# Altium schematic sheet AUDIO_INTERFACE.SchDoc
size A4; SheetNumber: 23; SheetTotal: 27
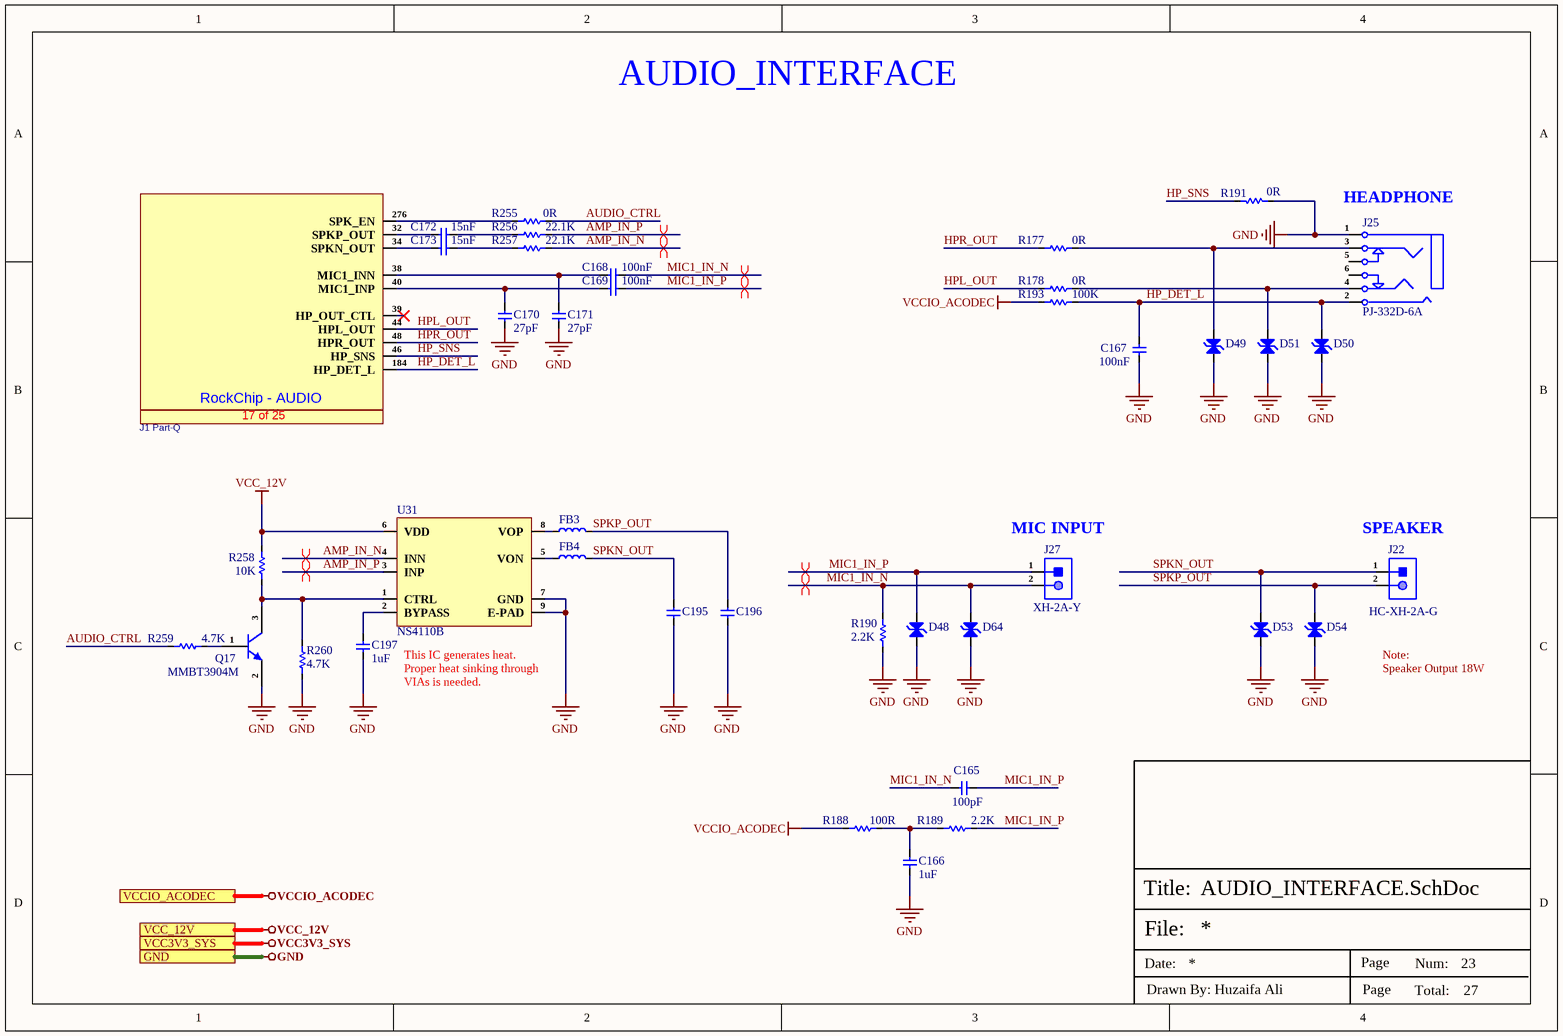
[diagram p0: AUDIO_INTERFACE.SchDoc]

## Parts
C165  100pF  [Cap-0402]
C166  1uF  [Cap-0402]
C167  100nF  [Cap-0402]
C168  100nF  [Cap-0402]
C169  100nF  [Cap-0402]
C170  27pF  [Cap-0402]
C171  27pF  [Cap-0402]
C172  15nF  [Cap-0402]
C173  15nF  [Cap-0402]
C195  (no value)  [CAP-0603]
C196  (no value)  [CAP-0603]
C197  1uF  [Cap-0603]
D48  ESD5451N  [DFN1006-2L (Bi-Directional)]  (value not drawn)
D49  ESD5451N  [DFN1006-2L (Bi-Directional)]  (value not drawn)
D50  ESD5451N  [DFN1006-2L (Bi-Directional)]  (value not drawn)
D51  ESD5451N  [DFN1006-2L (Bi-Directional)]  (value not drawn)
D53  ESD5451N  [DFN1006-2L (Bi-Directional)]  (value not drawn)
D54  ESD5451N  [DFN1006-2L (Bi-Directional)]  (value not drawn)
D64  ESD5451N  [DFN1006-2L (Bi-Directional)]  (value not drawn)
FB3  (no value)  [IND-1206]
FB4  (no value)  [IND-1206]
J1_Part-  AS0B826-S78B-7H  [AS0B826-S78B-7H]  (value not drawn)  (part Q of 25)
J22  HC-XH-2A-G  [HC-XH-2A-G]
J25  PJ-332D-6A  [PJ-332D-6A]
J27  XH-2A-Y  [XH-2A-Y]
Q17  MMBT3904M  [SOT-723]
R177  0R  [Res-0402]
R178  0R  [Res-0402]
R188  100R  [Res-0402]
R189  2.2K  [Res-0402]
R190  2.2K  [Res-0402]
R191  0R  [Res-0402]
R193  100K  [Res-0402]
R255  0R  [Res-0402]
R256  22.1K  [Res-0402]
R257  22.1K  [Res-0402]
R258  10K  [Res-0402]
R259  4.7K  [Res-0402]
R260  4.7K  [Res-0402]
U31  NS4110B  [8-SOIC-EP]

## Ports
GND (see TOP SHEET[3D], BUCK REGULATOR[3D], DEBUG_UART_INTERFACE[3D], DIGITAL IO_RELAY_SHEET[5D], DUAL_SIM_INTERFACE[3D], ETHERNET_PHY0[4D], ETHERNET_PHY1[4D], GSM_INTERFACE[2D], HDMI_INTERFACE[3D], INPUT_PROTECTION[3D], LINEAR_VOLTAGE_REG[3D], MICRO_SD_INTERFACE[3D], MIPI-DSI DISPLAY[3D], POWER SECTION[3D], PUSH BUTTONs_INTERFACE[3C], RGB_LEDs_INTERFACE[3D], ROCKCHIP_PWR_SUPPLY[1D], ROCKCHIP_SYSTEM_CONTROL[3C], RS232_RS485_INTERFACE[3C], SENSOR_SHEET[3D], USB2.0_INTERFACE[3D], USB3.0_INTERFACE[3D], USB-C_INTERFACE[2D], WIEGAND_INTERFACE[3D], WIFI_BLUETOOTH_SHEET[4C]), VCC3V3_SYS (see TOP SHEET[3D], BUCK REGULATOR[3D], DEBUG_UART_INTERFACE[3D], DIGITAL IO_RELAY_SHEET[5D], ETHERNET_PHY0[4D], ETHERNET_PHY1[4D], GSM_INTERFACE[2D], HDMI_INTERFACE[3D], LINEAR_VOLTAGE_REG[3D], MIPI-DSI DISPLAY[3D], POWER SECTION[3D], PUSH BUTTONs_INTERFACE[3C], ROCKCHIP_PWR_SUPPLY[1D], ROCKCHIP_SYSTEM_CONTROL[3C], RS232_RS485_INTERFACE[3C], SENSOR_SHEET[3D], USB-C_INTERFACE[2D], WIEGAND_INTERFACE[3D], WIFI_BLUETOOTH_SHEET[4C]), VCC_12V (see TOP SHEET[3D], BUCK REGULATOR[3D], INPUT_PROTECTION[3D], POWER SECTION[3D], PUSH BUTTONs_INTERFACE[3C], WIEGAND_INTERFACE[3D]), VCCIO_ACODEC (see TOP SHEET[3D], ROCKCHIP_PWR_SUPPLY[2D])

## Nets
GND: C166.1 C167.1 C170.1 C171.1 C195.1 C196.1 C197.1 D48.1(K) D49.1(K) D50.1(K) D51.1(K) D53.1(K) D54.1(K) D64.1(K) J25.1 Q17.2(E) R190.1 R191.1 R260.1 U31.7(GND) U31.9(E-PAD) ; port GND
VCC3V3_SYS: port VCC3V3_SYS
VCC_12V: R258.2 U31.6(VDD) ; port VCC_12V
VCCIO_ACODEC: R188.1 R193.2 ; port VCCIO_ACODEC
AMP_IN_N: R257.2 U31.4(INN)
AMP_IN_P: R256.2 U31.3(INP)
AUDIO_CTRL: R255.2 R259.1
HP_DET_L: C167.2 D50.2(K) J1_Part-.184(HP_DET_L) J25.2 R193.1
HP_SNS: J1_Part-.46(HP_SNS) R191.2
HPL_OUT: J1_Part-.44(HPL_OUT) R178.1
HPR_OUT: J1_Part-.48(HPR_OUT) R177.1
MIC1_IN_N: C165.2 C169.1 D64.2(K) J27.2 R190.2
MIC1_IN_P: C165.1 C168.1 D48.2(K) J27.1 R189.2
SPKN_OUT: C195.2 D53.2(K) FB4.2 J22.1
SPKP_OUT: C196.2 D54.2(K) FB3.2 J22.2
NetC166_2: C166.2 R188.2 R189.1
NetC168_2: C168.2 C170.2 J1_Part-.40(MIC1_INP)
NetC169_2: C169.2 C171.2 J1_Part-.38(MIC1_INN)
NetC172_1: C172.1 J1_Part-.32(SPKP_OUT)
NetC172_2: C172.2 R256.1
NetC173_1: C173.1 J1_Part-.34(SPKN_OUT)
NetC173_2: C173.2 R257.1
NetC197_2: C197.2 U31.2(BYPASS)
NetD49_2: D49.2(K) J25.3 R177.2
NetD51_2: D51.2(K) J25.4 R178.2
NetFB3_1: FB3.1 U31.8(VOP)
NetFB4_1: FB4.1 U31.5(VON)
NetJ1_Part-_276: J1_Part-.276(SPK_EN) R255.1
NetQ17_1: Q17.1(B) R259.2
NetQ17_3: Q17.3(C) R258.1 R260.2 U31.1(CTRL)

Not connected (* = marked no-connect by the designer): J1_Part- 39(HP_OUT_CTL)*; J25 5 6

## Layout directives
differential pair; differential pair class DIFF-AMP; rule Matched Net Lengths [Tolerance = 0.508mm]; rule Impedance Constraint [Min = 85.00    Max = 95.00    ]: AMP_IN_N, AMP_IN_P
differential pair; differential pair class DIFF-MIC; rule Matched Net Lengths [Tolerance = 0.508mm]; rule Impedance Constraint [Min = 85.00    Max = 95.00    ]: MIC1_IN_N, MIC1_IN_P

## Notes on the sheet
- AUDIO_INTERFACE
- (near J25) HEADPHONE
- (near J27) MIC INPUT
- (near J22) SPEAKER
- This IC generates heat. Proper heat sinking through VIAs is needed.
- Note:
  Speaker Output 18W
- File:
- Title:
- Date:
- Page
- Num:
- Total:
- Drawn By: Huzaifa Ali
- (in symbol AS0B826-S78B-7H, part Q) RockChip - AUDIO; 17 of 25

## Library data of the parts
C165 = CC0402JRNPO9BN101: CAP CER 100PF 50V C0G/NPO 0402; Manufacturer: Yageo; Dielectric Material: Ceramic; Tolerance: 5%; Dielectric: C0G; Temperature Coefficient: 30ppm/°C; Insulation Resistance: 100GR; Item Type: Capacitor; Supplier: Future Electronics; Supplier Part Number: 8934564; Manufacturer Part Number: CC0402JRNPO9BN101; RoHS: Yes; Category: Ceramic Capacitors; Stock: 11720000; Pricing: 10000=0.002, 40000=0.0019, 150000=0.0018, 400000=0.0018, 1000000=0.0017 (USD); Mounting Technology: Surface Mount; Case/Package: 0402; Pins: 2; Case Code (Imperial): 0402; Case Code (Metric): 1005; Min Operating Temperature: -55°C; Max Operating Temperature: 125°C; Value: 100pF; Voltage Rating: 50V; Voltage Rating (DC): 50V; Packaging: Tape and Reel; Package Quantity: 1; Termination: SMD/SMT; Voltage: 50V; Series: CC; Length: 1mm; Width: 0.02inch; Height: 0.5mm; Thickness: 0.022inch; Depth: 0.5mm; Radiation Hardening: No; RoHS Compliant: Yes; Reach SVHC Compliant: No; Lead Free: Lead Free; ComponentLink1URL: https://datasheet.ciiva.com/11786/0900766b80d84fbf-11786101.pdf?src-supplier=Rs; ComponentLink1Description: https://datasheet.ciiva.com/11786/0900766b80d84fbf-11786101.pdf?src-supplier=Rs; ComponentLink2URL: https://datasheet.ciiva.com/23767/25787-23767888.pdf?src-supplier=Newark; ComponentLink2Description: https://datasheet.ciiva.com/23767/25787-23767888.pdf?src-supplier=Newark; ComponentLink3URL: https://datasheet.ciiva.com/28450/1443161-28450220.pdf?src-supplier=Element14; ComponentLink3Description: https://datasheet.ciiva.com/28450/1443161-28450220.pdf?src-supplier=Element14; ComponentLink4URL: https://datasheet.ciiva.com/8033/1443161-8033598.pdf?src-supplier=Element14; ComponentLink4Description: https://datasheet.ciiva.com/8033/1443161-8033598.pdf?src-supplier=Element14; ComponentLink5URL: https://datasheet.ciiva.com/143/mlccorderingcode-143990.pdf?src-supplier=Digi-Key; ComponentLink5Description: https://datasheet.ciiva.com/143/mlccorderingcode-143990.pdf?src-supplier=Digi-Key; ComponentLink6URL: https://datasheet.ciiva.com/143/mlccorderingcode-143989.pdf?src-supplier=Digi-Key; ComponentLink6Description: https://datasheet.ciiva.com/143/mlccorderingcode-143989.pdf?src-supplier=Digi-Key; ComponentLink7URL: https://datasheet.ciiva.com/143/mlccorderingcode-143991.pdf?src-supplier=Digi-Key; ComponentLink7Description: https://datasheet.ciiva.com/143/mlccorderingcode-143991.pdf?src-supplier=Digi-Key; LCSC Part Number: C106200
C166 = CC0402KRX5R8BB105: CAP CER 1UF 25V X5R 0402; Manufacturer: Yageo; Tolerance: 10%; Supplier 1: Mouser; Manufacturer Part Number: CC0402KRX5R8BB105; RoHS: Yes; Category: Ceramic Capacitors; Stock 1: 91975; Pricing 1: 1=0.30000, 10=0.20400, 50=0.20400, 100=0.11600, 1000=0.07200, 10000=0.05900 (USD); Mount: Surface Mount; Case/Package: 0402; Case Code (Metric): 1005; Case Code (Imperial): 0402; Weight: 2.3E-05oz; Min Operating Temperature: -55°C; Max Operating Temperature: 85°C; Packaging: Tape and Reel; Capacitance: 1uF; Voltage Rating: 25V; Dielectric: X5R; Termination: SMD/SMT; Voltage Rating (DC): 25V; Package Quantity: 10000; Length: 0.039inch; Width: 0.02inch; Thickness: 0.022inch; Lead Free: Lead Free; Halogen Free: Halogen Free; RoHS Compliant: Yes; ComponentLink1URL: http://www.mouser.com/ds/2/447/Yageo_UPY-GP_NP0_16V-to-50V_9-358835.pdf?src-supplier=Mouser; ComponentLink1Description: http://www.mouser.com/ds/2/447/Yageo_UPY-GP_NP0_16V-to-50V_9-358835.pdf?src-supplier=Mouser; ComponentLink2URL: http://www.yageo.com/documents/recent/UPY-GPHC_X5R_4V-to-50V_25.pdf?src-supplier=Digi-Key; ComponentLink2Description: http://www.yageo.com/documents/recent/UPY-GPHC_X5R_4V-to-50V_25.pdf?src-supplier=Digi-Key; ComponentLink3URL: https://4donline.ihs.com/images/VipMasterIC/IC/YAGO/YAGO-S-A0006851646/YAGO-S-A0006851646-1.pdf?hkey=6D3A4C79FDBF58556ACFDE234799DDF0&src-supplier=Newark; ComponentLink3Description: https://4donline.ihs.com/images/VipMasterIC/IC/YAGO/YAGO-S-A0006851646/YAGO-S-A0006851646-1.pdf?hkey=6D3A4C79FDBF58556ACFDE234799DDF0&src-supplier=Newark; Supplier Part Number 1: 603-CC402KRX5R8BB105; LCSC Part Number: C326568
C167-C169 = CC0402KRX5R7BB104: CAP CER 0.1UF 16V X5R 0402; Manufacturer: Yageo; Tolerance: 10%; Manufacturer Part Number: CC0402KRX5R7BB104; RoHS: Yes; Category: Ceramic Capacitors; Supplier 1: Mouser; Stock 1: 936792; Pricing 1: 1=0.10000, 10=0.02300, 50=0.02300, 100=0.01100, 1000=0.00600, 10000=0.00400 (USD); Mount: Surface Mount; Case/Package: 0402; Number of Pins: 2; Case Code (Metric): 1005; Case Code (Imperial): 0402; Min Operating Temperature: -55°C; Max Operating Temperature: 85°C; Capacitance: 100nF; Dielectric: X5R; Packaging: Tape and Reel; Voltage Rating: 16V; Package Quantity: 1; Voltage Rating (DC): 16V; Termination: SMD/SMT; Resistor Type: Ceramic; Series: CC; Construction: Flat; Length: 1mm; Width: 0.02inch; Height: 0.5mm; Thickness: 0.022inch; Depth: 0.5mm; Radiation Hardening: No; REACH SVHC: Unknown; Lead Free: Lead Free; Halogen Free: Halogen Free; RoHS Compliant: Yes; ComponentLink1URL: https://datasheet.ciiva.com/155/mlccorderingcode-155879.pdf?src-supplier=Digi-Key; ComponentLink1Description: https://datasheet.ciiva.com/155/mlccorderingcode-155879.pdf?src-supplier=Digi-Key; ComponentLink2URL: https://datasheet.ciiva.com/155/mlccorderingcode-155878.pdf?src-supplier=Digi-Key; ComponentLink2Description: https://datasheet.ciiva.com/155/mlccorderingcode-155878.pdf?src-supplier=Digi-Key; ComponentLink3URL: https://datasheet.ciiva.com/155/mlccorderingcode-155880.pdf?src-supplier=Digi-Key; ComponentLink3Description: https://datasheet.ciiva.com/155/mlccorderingcode-155880.pdf?src-supplier=Digi-Key; ComponentLink4URL: https://datasheet.ciiva.com/11464/upy-gphc-x5r-4v-to-50v-12-11464869.pdf?src-supplier=Avnet; ComponentLink4Description: https://datasheet.ciiva.com/11464/upy-gphc-x5r-4v-to-50v-12-11464869.pdf?src-supplier=Avnet; Supplier Part Number 1: 603-CC402KRX5R7BB104; LCSC Part Number: C106204
C170 C171 = 0402N270J250CT: CAP CER 27PF 25V C0G/NP0 0402; Manufacturer: Walsin Technologies; Item Type: Capacitor; Supplier 1: Digi-Key; Manufacturer Part Number: 0402N270J250CT; Stock 1: 71180; Pricing 1: 1=0.1, 10=0.017, 50=0.0094, 100=0.0076, 500=0.00544, 1000=0.00427, 2500=0.00388, 5000=0.00357 (USD); RoHS Compliant: Yes; Supplier Part Number 1: 1292-1291-1-ND; LCSC Part Number: C424826; ComponentLink1Description: LCSC; ComponentLink1URL: https://lcsc.com/product-detail/Multilayer-Ceramic-Capacitors-MLCC-SMD-SMT_Walsin-Tech-Corp-0402N270J250CT_C424826.html
C172 C173 = CC0402KRX7R9BB153: CAP CER 0.015UF 50V X7R 0402; Manufacturer: Yageo; Tolerance: 10%; Item Type: Capacitor; Supplier: Future Electronics; Supplier Part Number: 1105976; Manufacturer Part Number: CC0402KRX7R9BB153; RoHS: Yes; Category: Ceramic Capacitors; Stock: 10000; Pricing: 10000=0.0032, 40000=0.0031, 150000=0.0029, 250000=0.0028, 500000=0.0027 (USD); Mounting Technology: Surface Mount; Case/Package: 0402; Min Operating Temperature: -55°C; Max Operating Temperature: 125°C; Packaging: Tape and Reel; Value: 15nF; Voltage Rating: 50V; Voltage Rating (DC): 50V; Dielectric: X7R; Series: CC; Length: 0.039inch; Width: 0.02inch; Thickness: 0.022inch; Lead Free: Lead Free; Halogen Free: Halogen Free; RoHS Compliant: Yes; ComponentLink1URL: https://datasheet.octopart.com/CC0402KRX7R9BB153-Yageo-datasheet-166511530.pdf?src-supplier=Future+Electronics; ComponentLink1Description: https://datasheet.octopart.com/CC0402KRX7R9BB153-Yageo-datasheet-166511530.pdf?src-supplier=Future+Electronics; ComponentLink2URL: https://datasheet.octopart.com/CC0402KRX7R9BB153-Yageo-datasheet-147453679.pdf?src-supplier=Newark; ComponentLink2Description: https://datasheet.octopart.com/CC0402KRX7R9BB153-Yageo-datasheet-147453679.pdf?src-supplier=Newark; ComponentLink3URL: http://www.yageo.com/documents/recent/UPY-GPHC_X7R_6.3V-to-50V_18.pdf?src-supplier=Digi-Key; ComponentLink3Description: http://www.yageo.com/documents/recent/UPY-GPHC_X7R_6.3V-to-50V_18.pdf?src-supplier=Digi-Key; ComponentLink4URL: https://www.yageo.com/upload/media/product/productsearch/datasheet/mlcc/UPY-GPHC_X7R_6.3V-to-50V_18.pdf?src-supplier=Digi-Key; ComponentLink4Description: https://www.yageo.com/upload/media/product/productsearch/datasheet/mlcc/UPY-GPHC_X7R_6.3V-to-50V_18.pdf?src-supplier=Digi-Key; ComponentLink5URL: https://datasheet.octopart.com/CC0402KRX7R9BB153-Yageo-datasheet-151948686.pdf?src-supplier=Farnell; ComponentLink5Description: https://datasheet.octopart.com/CC0402KRX7R9BB153-Yageo-datasheet-151948686.pdf?src-supplier=Farnell; ComponentLink6URL: http://www.yageo.com/exep/pages/download/literatures/ProductSelectionGuide%202014_Final_2.pdf?src-supplier=Digi-Key; ComponentLink6Description: http://www.yageo.com/exep/pages/download/literatures/ProductSelectionGuide%202014_Final_2.pdf?src-supplier=Digi-Key; LCSC Part Number: C114405
C195 C196 = CC0603JRNPO8BN102: CAP CER 1000PF 25V C0G/NPO 0603; Manufacturer: Yageo; Capacitance: 1nF; Tolerance: 5%; Dielectric: C0G; Item Type: Capacitor; Supplier 1: Digi-Key; Manufacturer Part Number: CC0603JRNPO8BN102; Stock 1: 290818; Pricing 1: 1=0.1, 10=0.072, 50=0.0394, 100=0.0322, 500=0.02298, 1000=0.01806 (USD); Mount: Surface Mount; Case/Package: 0603; Case Code (Metric): 1608; Case Code (Imperial): 0603; Min Operating Temperature: -55°C; Max Operating Temperature: 125°C; Voltage Rating: 25V; Packaging: Tape and Reel; Package Quantity: 1; Termination: SMD/SMT; Voltage Rating (DC): 25V; Series: CC; Construction: Flat; Length: 1.6mm; Width: 0.031inch; Height: 0.8mm; Thickness: 0.035inch; Depth: 0.8mm; Radiation Hardening: No; REACH SVHC: Unknown; Lead Free: Lead Free; RoHS Compliant: Yes; ComponentLink1URL: http://www.farnell.com/datasheets/1132289.pdf?src-supplier=Element14; ComponentLink1Description: http://www.farnell.com/datasheets/1132289.pdf?src-supplier=Element14; ComponentLink2URL: http://www.farnell.com/datasheets/2213336.pdf?src-supplier=Element14; ComponentLink2Description: http://www.farnell.com/datasheets/2213336.pdf?src-supplier=Element14; ComponentLink3URL: http://www.yageo.com/documents/recent/UPY-GP_NP0_16V-to-50V_16.pdf?src-supplier=Digi-Key; ComponentLink3Description: http://www.yageo.com/documents/recent/UPY-GP_NP0_16V-to-50V_16.pdf?src-supplier=Digi-Key; ComponentLink4URL: http://www.yageo.com/exep/pages/download/literatures/ProductSelectionGuide%202014_Final_2.pdf?src-supplier=Digi-Key; ComponentLink4Description: http://www.yageo.com/exep/pages/download/literatures/ProductSelectionGuide%202014_Final_2.pdf?src-supplier=Digi-Key; ComponentLink5URL: http://www.yageo.com/documents/recent/UPY-GP_NP0_16V-to-50V_8.pdf?src-supplier=Avnet; ComponentLink5Description: http://www.yageo.com/documents/recent/UPY-GP_NP0_16V-to-50V_8.pdf?src-supplier=Avnet; ComponentLink6URL: https://www.verical.com/server-webapp/html/getDatasheet?partID=403523&src-supplier=Verical; ComponentLink6Description: https://www.verical.com/server-webapp/html/getDatasheet?partID=403523&src-supplier=Verical; ComponentLink7URL: http://www.yageo.com/documents/recent/UPY-GP_NP0_16V-to-50V_8.pdf?src-supplier=Avnet+Europe; ComponentLink7Description: http://www.yageo.com/documents/recent/UPY-GP_NP0_16V-to-50V_8.pdf?src-supplier=Avnet+Europe; Supplier Part Number 1: 311-1342-1-ND; LCSC Part Number: C309470
C197 = CC0603KRX5R8BB105: CAP CER 1UF 25V X5R 0603; Manufacturer: Yageo; Tolerance: 10%; Item Type: Capacitor; Supplier 1: Digi-Key; Manufacturer Part Number: CC0603KRX5R8BB105; RoHS: Yes; Category: Ceramic Capacitors; Stock 1: 919939; Pricing 1: 1=0.12000, 10=0.08400, 50=0.04760, 100=0.03940, 500=0.02764, 1000=0.02288 (USD); Mount: Surface Mount; Case/Package: 0603; Number of Pins: 2; Case Code (Metric): 1608; Case Code (Imperial): 0603; Min Operating Temperature: -55°C; Max Operating Temperature: 85°C; Capacitance: 1uF; Dielectric: X5R; Package Quantity: 1; Voltage Rating: 25V; Packaging: Tape and Reel; Termination: SMD/SMT; Voltage Rating (DC): 25V; Series: CC; Construction: Flat; Length: 1.6mm; Width: 0.031inch; Height: 0.8mm; Thickness: 0.035inch; Depth: 0.8mm; Radiation Hardening: No; REACH SVHC: No SVHC; Lead Free: Lead Free; Halogen Free: Halogen Free; RoHS Compliant: Yes; ComponentLink1URL: https://datasheet.ciiva.com/176/mlccorderingcode-176785.pdf?src-supplier=Digi-Key; ComponentLink1Description: https://datasheet.ciiva.com/176/mlccorderingcode-176785.pdf?src-supplier=Digi-Key; ComponentLink2URL: https://datasheet.ciiva.com/176/mlccorderingcode-176786.pdf?src-supplier=Digi-Key; ComponentLink2Description: https://datasheet.ciiva.com/176/mlccorderingcode-176786.pdf?src-supplier=Digi-Key; ComponentLink3URL: https://datasheet.ciiva.com/176/mlccorderingcode-176787.pdf?src-supplier=Digi-Key; ComponentLink3Description: https://datasheet.ciiva.com/176/mlccorderingcode-176787.pdf?src-supplier=Digi-Key; ComponentLink4URL: https://datasheet.ciiva.com/17436/upy-gphc-x5r-4v-to-50v-12-17436952.pdf?src-supplier=Avnet+Europe; ComponentLink4Description: https://datasheet.ciiva.com/17436/upy-gphc-x5r-4v-to-50v-12-17436952.pdf?src-supplier=Avnet+Europe; ComponentLink5URL: https://datasheet.ciiva.com/7978/1525783-7978171.pdf?src-supplier=Element14; ComponentLink5Description: https://datasheet.ciiva.com/7978/1525783-7978171.pdf?src-supplier=Element14; ComponentLink6URL: https://datasheet.ciiva.com/11586/upy-gphc-x5r-4v-to-50v-12-11586318.pdf?src-supplier=Avnet; ComponentLink6Description: https://datasheet.ciiva.com/11586/upy-gphc-x5r-4v-to-50v-12-11586318.pdf?src-supplier=Avnet; Supplier Part Number 1: 311-1445-1-ND; LCSC Part Number: C14664
D48-D51 D53 D54 D64 = ESD5451N: DFN1006-2(0402) ESD Protection Devices ROHS; Manufacturer: TECH PUBLIC; Manufacturer Part Number: ESD5451N; Footprint: DFN1006-2(0402); ComponentLink1Description: LCSC; ComponentLink1URL: https://www.lcsc.com/product-detail/span-style-background-color-ff0-ESD-span-Protection-Devices_TECH-PUBLIC-ESD5451N_C2936977.html; LCSC Part Number: C2936977
FB3 FB4 = BLM31KN102SN1L: FERRITE BEAD 1K OHM 1206 1LN; Manufacturer: Murata; Supplier: Arrow Electronics; Supplier Part Number: BLM31KN102SN1L; Manufacturer Part Number: BLM31KN102SN1L; RoHS: Yes; Category: Ferrite Beads and Chips; Stock: 4330; Pricing: 1=0.2698, 10=0.1868, 25=0.1802, 100=0.1517, 250=0.1332, 500=0.1205, 1000=0.1021, 3000=0.1013 (USD); ComponentLink1URL: https://datasheet.octopart.com/BLM31KN102SN1L-Murata-datasheet-127191117.pdf?src-supplier=Future+Electronics; ComponentLink1Description: https://datasheet.octopart.com/BLM31KN102SN1L-Murata-datasheet-127191117.pdf?src-supplier=Future+Electronics; ComponentLink2URL: https://www.murata.com/en-global/products/productdata/8796739698718/ENFA0006.pdf?src-supplier=Digi-Key; ComponentLink2Description: https://www.murata.com/en-global/products/productdata/8796739698718/ENFA0006.pdf?src-supplier=Digi-Key; ComponentLink3URL: https://datasheet.octopart.com/BLM31KN102SN1L-Murata-datasheet-137977741.pdf?src-supplier=Element14; ComponentLink3Description: https://datasheet.octopart.com/BLM31KN102SN1L-Murata-datasheet-137977741.pdf?src-supplier=Element14; LCSC Part Number: C560056; Item Type: Ferrite Bead
J1_Part- = AS0B826-S78B-7H: SMD,P=0.5mm,Surface Mount，Right Angle; Manufacturer: FOXCONN; Item Type: Card Edge Connectors; Supplier: LCSC; Manufacturer Part Number: AS0B826-S78B-7H; RoHS: No; Stock: 4979; Pricing: 1=9.21, 10=8.287, 25=7.8064, 50=7.6064, 100=7.4062 (USD); LCSC Part Number: C426232
J22 = HC-XH-2A-G: 1x2P XH 1 2.54mm 2.54mm Male pin 2 -25℃~+85℃ 3A Straight Straight,P=2.5mm Wire To Board / Wire To Wire Connector ROHS; Manufacturer: HCTL; Item Type: JST Connector; Manufacturer Part Number: HC-XH-2A-G; Package: Straight,P=2.5mm; LCSC Part Number: C5341201; ComponentLink1Description: LCSC; ComponentLink1URL: https://www.lcsc.com/product-detail/Wire-To-Board-Wire-To-Wire-Connector_HCTL-HC-XH-2A-G_C5341201.html
J25 = PJ-332D-6A: 3.5mm headphone jack 1A SMD Audio Connectors ROHS; Manufacturer: Korean Hroparts Elec; Manufacturer Part Number: PJ-332D-6A; Package: SMD; LCSC Part Number: C840336; Item Type: Audio Connector; ComponentLink1Description: LCSC; ComponentLink1URL: https://www.lcsc.com/product-detail/Audio-Connectors_Korean-Hroparts-Elec-PJ-332D-6A_C840336.html
J27 = XH-2A-Y: 1x2P 2P XH 1 Tin 2.5mm 2 -25℃~+85℃ Brass 3A Straight Plugin,P=2.5mm Wire To Board Connector ROHS; Manufacturer: HCTL; Manufacturer Part Number: XH-2A-Y; Package: Plugin,P=2.5mm; LCSC Part Number: C2908595; Item Type: Wire To Board Connector; ComponentLink1Description: LCSC; ComponentLink1URL: https://www.lcsc.com/product-detail/Wire-To-Board-Connector_HCTL-XH-2A-Y_C2908595.html
Q17 = MMBT3904M: 40V 100mW 100@10mA,1V 200mA 300MHz 300mV@50mA,5mA NPN -55℃~+150℃@(Tj) SOT-723 Bipolar Transistors - BJT ROHS; Manufacturer: TECH PUBLIC; Item Type: Mosfet; ComponentLink1Description: LCSC; ComponentLink1URL: https://www.lcsc.com/product-detail/Bipolar-Transistors-BJT_TECH-PUBLIC-MMBT3904M_C2923360.html; Manufacturer Part Number: MMBT3904M; Package: SOT-723; LCSC Part Number: C2923360
R177 R178 R191 R255 = RC0402FR-070RL: RES 0 OHM JUMPER 1/16W 0402; Manufacturer: Yageo; Tolerance: 1%; Power Rating: 62.5mW; Voltage Rating: 50V; Temperature Coefficient: 200ppm/°C; Max Power Dissipation: 63mW; Supplier 1: Mouser; Manufacturer Part Number: RC0402FR-070RL; RoHS: Yes; Category: Chip SMD Resistors; Stock 1: 8556842; Pricing 1: 1=0.10000, 10=0.01400, 50=0.01400, 100=0.00600, 1000=0.00300, 5000=0.00200, 10000=0.00100 (USD); Mount: Surface Mount; Case/Package: 0402; Contact Plating: Tin,Matte; Case Code (Imperial): 0402; Case Code (Metric): 1005; Size Code: 0402; Min Operating Temperature: -55°C; Max Operating Temperature: 155°C; Resistance: 0R; Resistor Type: Thick Film; Packaging: Tape and Reel; Termination: SMD/SMT; Features: Moisture Resistant; Series: RC; Number of Terminations: 2; Length: 1mm; Width: 0.5mm; Height: 0.35mm; Radiation Hardening: No; Lead Free: Lead Free; RoHS Compliant: Yes; ComponentLink1URL: https://datasheet.ciiva.com/8896/pyu-rc0402-51-rohs-l-6-8896149.pdf?src-supplier=Avnet; ComponentLink1Description: https://datasheet.ciiva.com/8896/pyu-rc0402-51-rohs-l-6-8896149.pdf?src-supplier=Avnet; ComponentLink2URL: https://datasheet.ciiva.com/16790/pyu-rc0402-51-rohs-l-6-r-16790444.pdf?src-supplier=Future+Electronics; ComponentLink2Description: https://datasheet.ciiva.com/16790/pyu-rc0402-51-rohs-l-6-r-16790444.pdf?src-supplier=Future+Electronics; Supplier Part Number 1: 603-RC0402FR-070RL; LCSC Part Number: C106231
R188 = RC0402FR-07100RL: RES 100 OHM 1% 1/16W 0402; Manufacturer: Yageo; Power Rating: 62.5mW; Voltage Rating: 50V; Temperature Coefficient: 100ppm/°C; Max Power Dissipation: 63mW; Item Type: Resistor; Supplier 1: Mouser; Manufacturer Part Number: RC0402FR-07100RL; RoHS: Yes; Category: Chip SMD Resistors; Stock 1: 699545; Pricing 1: 1=0.10000, 10=0.01200, 50=0.01200, 100=0.00500, 1000=0.00300, 2500=0.00200, 10000=0.00100 (USD); Case/Package: 0402; Number of Pins: 2; Case Code (Imperial): 0402; Case Code (Metric): 1005; Size Code: 0402; Min Operating Temperature: -55°C; Max Operating Temperature: 155°C; Tolerance: 1%; Voltage Rating (DC): 50V; Resistance: 100R; Packaging: Tape and Reel; Termination: SMD/SMT; Resistor Type: Thick Film; Features: Moisture Resistant; Series: RC; Number of Terminations: 2; Resistance Tolerance: 1%; Construction: Rectangular; Technology: THICK FILM; Length: 1mm; Width: 0.5mm; Height: 0.32mm; Depth: 0.5mm; RoHS Compliant: Yes; REACH SVHC: No SVHC; Military Standard: Not; Lead Free: Lead Free; ComponentLink1URL: https://datasheet.ciiva.com/11808/0900766b80c66297-11808765.pdf?src-supplier=RSComponents; ComponentLink1Description: https://datasheet.ciiva.com/11808/0900766b80c66297-11808765.pdf?src-supplier=RSComponents; ComponentLink2URL: https://datasheet.ciiva.com/7849/1784430-7849810.pdf?src-supplier=Element14; ComponentLink2Description: https://datasheet.ciiva.com/7849/1784430-7849810.pdf?src-supplier=Element14; ComponentLink3URL: https://datasheet.ciiva.com/28367/1018594-28367226.pdf?src-supplier=Element14; ComponentLink3Description: https://datasheet.ciiva.com/28367/1018594-28367226.pdf?src-supplier=Element14; ComponentLink4URL: https://datasheet.ciiva.com/22747/1018594-22747511.pdf?src-supplier=Element14; ComponentLink4Description: https://datasheet.ciiva.com/22747/1018594-22747511.pdf?src-supplier=Element14; ComponentLink5URL: https://datasheet.ciiva.com/12667/pyu-rc0402-51-rohs-l-6-r-12667957.pdf?src-supplier=Mouser; ComponentLink5Description: https://datasheet.ciiva.com/12667/pyu-rc0402-51-rohs-l-6-r-12667957.pdf?src-supplier=Mouser; ComponentLink6URL: https://datasheet.ciiva.com/15189/getdatasheetpartid-329466-15189335.pdf?src-supplier=Verical; ComponentLink6Description: https://datasheet.ciiva.com/15189/getdatasheetpartid-329466-15189335.pdf?src-supplier=Verical; ComponentLink7URL: https://datasheet.ciiva.com/16740/pyu-rc0402-51-rohs-l-6-r-16740566.pdf?src-supplier=Future+Electronics; ComponentLink7Description: https://datasheet.ciiva.com/16740/pyu-rc0402-51-rohs-l-6-r-16740566.pdf?src-supplier=Future+Electronics; Supplier Part Number 1: 603-RC0402FR-07100RL; LCSC Part Number: C106232
R189 R190 = RC0402FR-072K2L: RES SMD 2.2K OHM 1% 1/16W 0402; Manufacturer: Yageo; Resistance: 2.2kR; Power Rating: 63mW; Voltage Rating: 50V; Temperature Coefficient: 100ppm/°C; Supplier 1: Digi-Key; Manufacturer Part Number: RC0402FR-072K2L; Stock 1: 966157; Pricing 1: 1=0.1, 10=0.016, 100=0.0066, 1000=0.00299, 2500=0.00259, 5000=0.00214 (USD); Case/Package: 0402; Case Code (Imperial): 0402; Case Code (Metric): 1005; Weight: 2.3E-05oz; Size Code: 0402; Min Operating Temperature: -55°C; Max Operating Temperature: 155°C; Resistor Type: Thick Film; Packaging: Tape and Reel; Tolerance: 1%; Termination: SMD/SMT; Features: Moisture Resistant; Series: RC; Max Power Dissipation: 63mW; Number of Terminations: 2; Resistance Tolerance: 1%; Construction: Rectangular; Technology: THICK FILM; Length: 1mm; Width: 0.5mm; Height: 0.35mm; Depth: 0.5mm; RoHS Compliant: Yes; REACH SVHC: Unknown; Military Standard: Not; Lead Free: Lead Free; ComponentLink1URL: http://www.farnell.com/datasheets/2167052.pdf?src-supplier=Element14; ComponentLink1Description: http://www.farnell.com/datasheets/2167052.pdf?src-supplier=Element14; ComponentLink2URL: http://www.yageo.com/documents/recent/PYu-RC_Group_51_RoHS_L_9.pdf?src-supplier=Mouser; ComponentLink2Description: http://www.yageo.com/documents/recent/PYu-RC_Group_51_RoHS_L_9.pdf?src-supplier=Mouser; ComponentLink3URL: http://documents.rs-components.com/techlib://itc_doclist_GB.htm?stockno=6186532&src-supplier=RSComponents; ComponentLink3Description: http://documents.rs-components.com/techlib://itc_doclist_GB.htm?stockno=6186532&src-supplier=RSComponents; ComponentLink4URL: http://www.yageo.com/documents/recent/PYu-RC0402_51_RoHS_L_6_r.pdf?src-supplier=Future+Electronics; ComponentLink4Description: http://www.yageo.com/documents/recent/PYu-RC0402_51_RoHS_L_6_r.pdf?src-supplier=Future+Electronics; Supplier Part Number 1: 311-2.20KLRCT-ND; LCSC Part Number: C114762
R193 = RC0402FR-07100KL: RES 100K OHM 1% 1/16W 0402; Manufacturer: Yageo; Resistance: 100kR; Temperature Coefficient: 100ppm/°C; Power Rating: 63mW; Voltage Rating: 50V; Item Type: Resistor; Supplier 1: Mouser; Manufacturer Part Number: RC0402FR-07100KL; RoHS: Yes; Category: Chip SMD Resistors; Stock 1: 7759549; Pricing 1: 1=0.10000, 10=0.01200, 50=0.01200, 100=0.00500, 1000=0.00300, 2500=0.00200, 10000=0.00100 (USD); Case/Package: 0402; Case Code (Metric): 1005; Case Code (Imperial): 0402; Min Operating Temperature: -55°C; Max Operating Temperature: 155°C; Resistor Type: Thick Film; Tolerance: 1%; Packaging: Tape and Reel; Package Quantity: 1; Number of Terminations: 2; Termination: SMD/SMT; Max Power Dissipation: 63mW; Working Voltage: 50V; Features: Moisture Resistant; Series: RC; Resistance Tolerance: 1%; Construction: Rectangular; Technology: THICK FILM; Length: 0.039inch; Width: 0.02inch; Height: 0.016inch; Depth: 0.5mm; REACH SVHC: No SVHC; Lead Free: Lead Free; RoHS Compliant: Yes; Military Standard: Not; ComponentLink1URL: https://datasheet.ciiva.com/11819/0900766b80c66297-11819452.pdf?src-supplier=RSComponents; ComponentLink1Description: https://datasheet.ciiva.com/11819/0900766b80c66297-11819452.pdf?src-supplier=RSComponents; ComponentLink2URL: https://datasheet.ciiva.com/22747/1018594-22747509.pdf?src-supplier=Element14; ComponentLink2Description: https://datasheet.ciiva.com/22747/1018594-22747509.pdf?src-supplier=Element14; ComponentLink3URL: https://datasheet.ciiva.com/2453/pyu-r-int-thick-7-2453362.pdf?src-supplier=Digi-Key; ComponentLink3Description: https://datasheet.ciiva.com/2453/pyu-r-int-thick-7-2453362.pdf?src-supplier=Digi-Key; ComponentLink4URL: https://datasheet.ciiva.com/2453/pyu-r-int-thick-7-2453363.pdf?src-supplier=Digi-Key; ComponentLink4Description: https://datasheet.ciiva.com/2453/pyu-r-int-thick-7-2453363.pdf?src-supplier=Digi-Key; ComponentLink5URL: https://datasheet.ciiva.com/2453/pyu-r-int-thick-7-2453361.pdf?src-supplier=Digi-Key; ComponentLink5Description: https://datasheet.ciiva.com/2453/pyu-r-int-thick-7-2453361.pdf?src-supplier=Digi-Key; ComponentLink6URL: https://datasheet.ciiva.com/12667/pyu-rc0402-51-rohs-l-6-r-12667930.pdf?src-supplier=Mouser; ComponentLink6Description: https://datasheet.ciiva.com/12667/pyu-rc0402-51-rohs-l-6-r-12667930.pdf?src-supplier=Mouser; ComponentLink7URL: https://datasheet.ciiva.com/15189/getdatasheetpartid-323696-15189334.pdf?src-supplier=Verical; ComponentLink7Description: https://datasheet.ciiva.com/15189/getdatasheetpartid-323696-15189334.pdf?src-supplier=Verical; Supplier Part Number 1: 603-RC0402FR-07100KL; LCSC Part Number: C60491
R256 R257 = RT0402BRD0722K1L: RES SMD 22.1KOHM 0.1% 1/16W 0402; Manufacturer: Yageo; Value: 22.1kR; Power Rating: 62.5mW; Voltage Rating: 50V; Max Power Dissipation: 63mW; Temperature Coefficient: 25ppm/°C; Item Type: Resistor; Supplier 1: Arrow Electronics; Manufacturer Part Number: RT0402BRD0722K1L; RoHS: Yes; Category: Chip SMD Resistors; Stock 1: 40000; Pricing 1: 10000=0.0417, 20000=0.0733, 30000=0.041, 40000=0.0719, 50000=0.0402, 100000=0.0393 (USD); Case/Package: 0402; Case Code (Metric): 1005; Case Code (Imperial): 0402; Weight: 2.3E-05oz; Min Operating Temperature: -55°C; Max Operating Temperature: 155°C; Tolerance: 0.1%; Packaging: Tape and Reel; Package Quantity: 10000; Number of Terminations: 2; Termination: SMD/SMT; Voltage Rating (DC): 50V; Series: RT; Length: 0.039inch; Width: 0.5mm; Height: 0.014inch; Lead Free: Lead Free; RoHS Compliant: Yes; ComponentLink1URL: https://datasheet.ciiva.com/2582/pyu-rt-1-to-0-05-rohs-l-5-2582235.pdf?src-supplier=Digi-Key; ComponentLink1Description: https://datasheet.ciiva.com/2582/pyu-rt-1-to-0-05-rohs-l-5-2582235.pdf?src-supplier=Digi-Key; ComponentLink2URL: https://datasheet.ciiva.com/12797/pyu-rt-1-to-0-05-rohs-l-4-12797086.pdf?src-supplier=Mouser; ComponentLink2Description: https://datasheet.ciiva.com/12797/pyu-rt-1-to-0-05-rohs-l-4-12797086.pdf?src-supplier=Mouser; Supplier Part Number 1: RT0402BRD0722K1L; LCSC Part Number: C852648
R258 = RC0402FR-0710KL: RES 10K OHM 1% 1/16W 0402; Manufacturer: Yageo; Resistance: 10kR; Voltage Rating (DC): 50V; Temperature Coefficient: 100ppm/°C; Power Rating: 62.5mW; Max Power Dissipation: 63mW; Item Type: Resistor; Supplier 1: Mouser; Manufacturer Part Number: RC0402FR-0710KL; RoHS: Yes; Category: Chip SMD Resistors; Stock 1: 18648329; Pricing 1: 1=0.10000, 10=0.01400, 50=0.01400, 100=0.00500, 1000=0.00300, 10000=0.00200 (USD); Case/Package: 0402; Number of Pins: 2; Case Code (Imperial): 0402; Case Code (Metric): 1005; Min Operating Temperature: -55°C; Max Operating Temperature: 155°C; Resistor Type: Thick Film; Tolerance: 1%; Packaging: Tape and Reel; Voltage Rating: 50V; Termination: SMD/SMT; Working Voltage: 50V; Number of Terminations: 2; Features: Moisture Resistant; Series: RC; Resistance Tolerance: 1%; Construction: Rectangular; Length: 1mm; Width: 0.5mm; Height: 0.32mm; Depth: 0.5mm; Lead Pitch: 0.2mm; REACH SVHC: No SVHC; Lead Free: Lead Free; RoHS Compliant: Yes; Military Standard: Not; ComponentLink1URL: https://datasheet.ciiva.com/7660/38568-7660787.pdf?src-supplier=Element14; ComponentLink1Description: https://datasheet.ciiva.com/7660/38568-7660787.pdf?src-supplier=Element14; ComponentLink2URL: https://datasheet.ciiva.com/7849/1686128-7849814.pdf?src-supplier=Element14; ComponentLink2Description: https://datasheet.ciiva.com/7849/1686128-7849814.pdf?src-supplier=Element14; ComponentLink3URL: https://datasheet.ciiva.com/7983/1018594-7983486.pdf?src-supplier=Element14; ComponentLink3Description: https://datasheet.ciiva.com/7983/1018594-7983486.pdf?src-supplier=Element14; ComponentLink4URL: https://datasheet.ciiva.com/22747/1018594-22747512.pdf?src-supplier=Element14; ComponentLink4Description: https://datasheet.ciiva.com/22747/1018594-22747512.pdf?src-supplier=Element14; ComponentLink5URL: https://datasheet.ciiva.com/12667/pyu-rc0402-51-rohs-l-6-r-12667067.pdf?src-supplier=Mouser; ComponentLink5Description: https://datasheet.ciiva.com/12667/pyu-rc0402-51-rohs-l-6-r-12667067.pdf?src-supplier=Mouser; ComponentLink6URL: https://datasheet.ciiva.com/7849/1784430-7849813.pdf?src-supplier=Element14; ComponentLink6Description: https://datasheet.ciiva.com/7849/1784430-7849813.pdf?src-supplier=Element14; ComponentLink7URL: https://datasheet.ciiva.com/7849/1784430-7849815.pdf?src-supplier=Element14; ComponentLink7Description: https://datasheet.ciiva.com/7849/1784430-7849815.pdf?src-supplier=Element14; Supplier Part Number 1: 603-RC0402FR-0710KL; LCSC Part Number: C60490
R259 R260 = RC0402FR-074K7L: RES 4.7K OHM 1% 1/16W 0402; Manufacturer: Yageo; Voltage Rating (DC): 50V; Power Rating: 62.5mW; Resistance: 4.7kR; Temperature Coefficient: 100ppm/°C; Max Power Dissipation: 63mW; Item Type: Resistor; Supplier 1: Avnet; Manufacturer Part Number: RC0402FR-074K7L; RoHS: Yes; Category: Chip SMD Resistors; Stock 1: 2420000; Pricing 1: 10000=0.00085 (USD); Case/Package: 0402; Number of Pins: 2; Case Code (Imperial): 0402; Case Code (Metric): 1005; Size Code: 0402; Min Operating Temperature: -55°C; Max Operating Temperature: 155°C; Tolerance: 1%; Voltage Rating: 50V; Packaging: Tape and Reel; Resistor Type: Thick Film; Termination: SMD/SMT; Features: Moisture Resistant; Series: RC; Number of Terminations: 2; Resistance Tolerance: 1%; Construction: Rectangular; Length: 1mm; Width: 0.5mm; Height: 0.32mm; Depth: 0.5mm; Height - Seated (Max): 0.016inch; RoHS Compliant: Yes; Reach SVHC Compliant: Yes; Military Standard: Not; Lead Free: Lead Free; ComponentLink1URL: https://datasheet.ciiva.com/22661/1686128-22661342.pdf?src-supplier=Element14; ComponentLink1Description: https://datasheet.ciiva.com/22661/1686128-22661342.pdf?src-supplier=Element14; ComponentLink2URL: https://datasheet.ciiva.com/7850/1018594-7850022.pdf?src-supplier=Element14; ComponentLink2Description: https://datasheet.ciiva.com/7850/1018594-7850022.pdf?src-supplier=Element14; ComponentLink3URL: https://datasheet.ciiva.com/7850/1018594-7850023.pdf?src-supplier=Element14; ComponentLink3Description: https://datasheet.ciiva.com/7850/1018594-7850023.pdf?src-supplier=Element14; ComponentLink4URL: https://datasheet.ciiva.com/15215/getdatasheetpartid-328119-15215035.pdf?src-supplier=Verical; ComponentLink4Description: https://datasheet.ciiva.com/15215/getdatasheetpartid-328119-15215035.pdf?src-supplier=Verical; Supplier Part Number 1: RC0402FR-074K7L; LCSC Part Number: C105871
U31 = NS4110B: SOP-8-EP Audio Power OpAmps ROHS; Manufacturer: Shenzhen Nsiway Tech; Item Type: IC; Manufacturer Part Number: NS4110B; Package: SOP-8-EP; LCSC Part Number: C5334145; ComponentLink1Description: LCSC; ComponentLink1URL: https://www.lcsc.com/product-detail/Audio-Power-OpAmps_Shenzhen-Nsiway-Tech-NS4110B_C5334145.html